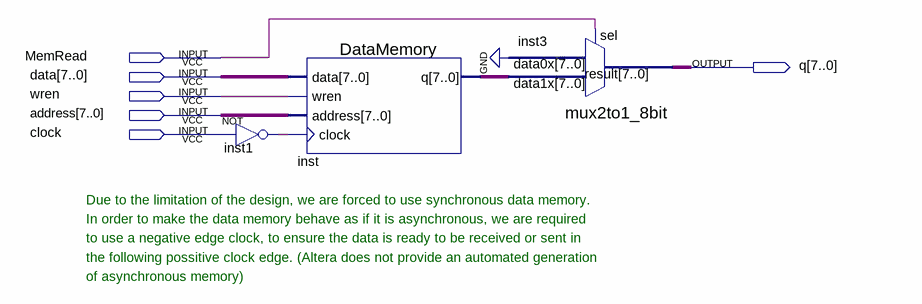
[diagram p0: schematic sheet]
// Quartus schematic memory.bdf as structural Verilog: 3 symbols, 6 pins
module memory (
  input  MemRead,
  input  [7:0] data,
  input  wren,
  input  [7:0] address,
  input  clock,
  output [7:0] q
);

  wire inst1_out;
  wire [7:0] inst_q;

  not inst1 (inst1_out, clock);
  DataMemory inst (.data(data), .wren(wren), .address(address), .clock(inst1_out), .q(inst_q));
  mux2to1_8bit inst3 (.data1x(inst_q), .data0x({8{1'b0}}), .sel(MemRead), .result(q));

  // Notes on the sheet:
  //   Due to the limitation of the design, we are forced to use synchronous data memory.
  //   In order to make the data memory behave as if it is asynchronous, we are required
  //   to use a negative edge clock, to ensure the data is ready to be received or sent in
  //   the following possitive clock edge. (Altera does not provide an automated generation
  //   of asynchronous memory)
endmodule
